# Altium schematic sheet main.SchDoc
size A4; SheetNumber: 1; SheetTotal: 4
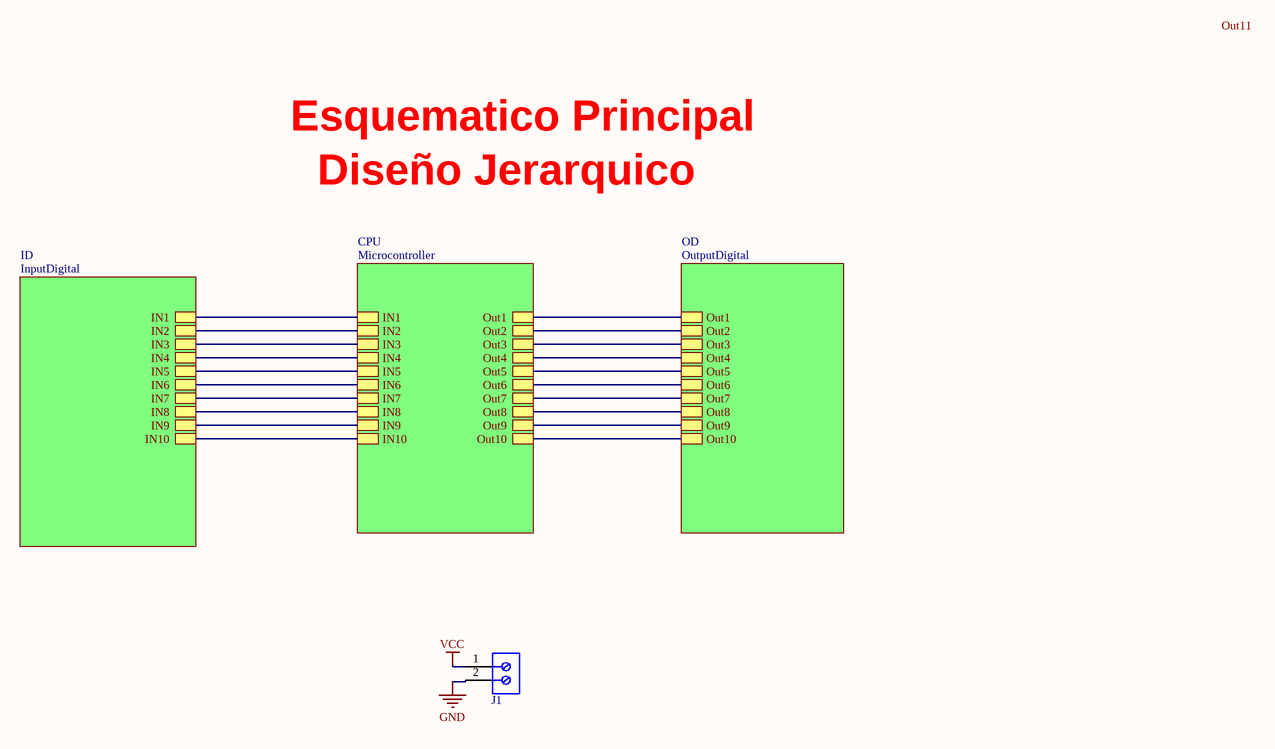
[diagram p0: main.SchDoc]

## Parts
J1  691214110002  [691214110002]  (value not drawn)

## Sub-sheets
CPU = Microcontroller: IN1, IN2, IN3, IN4, IN5, IN6, IN7, IN8, IN9, IN10, Out1, Out2, Out3, Out4, Out5, Out6, Out7, Out8, Out9, Out10
ID = InputDigital: IN1, IN2, IN3, IN4, IN5, IN6, IN7, IN8, IN9, IN10
OD = OutputDigital: Out1, Out2, Out3, Out4, Out5, Out6, Out7, Out8, Out9, Out10

## Nets
GND: J1.2
VCC: J1.1
(unnamed): sheet ID/IN1, sheet CPU/IN1
(unnamed): sheet ID/IN2, sheet CPU/IN2
(unnamed): sheet ID/IN3, sheet CPU/IN3
(unnamed): sheet ID/IN4, sheet CPU/IN4
(unnamed): sheet ID/IN5, sheet CPU/IN5
(unnamed): sheet ID/IN6, sheet CPU/IN6
(unnamed): sheet ID/IN7, sheet CPU/IN7
(unnamed): sheet ID/IN8, sheet CPU/IN8
(unnamed): sheet ID/IN9, sheet CPU/IN9
(unnamed): sheet ID/IN10, sheet CPU/IN10
(unnamed): sheet CPU/Out1, sheet OD/Out1
(unnamed): sheet CPU/Out2, sheet OD/Out2
(unnamed): sheet CPU/Out3, sheet OD/Out3
(unnamed): sheet CPU/Out4, sheet OD/Out4
(unnamed): sheet CPU/Out5, sheet OD/Out5
(unnamed): sheet CPU/Out6, sheet OD/Out6
(unnamed): sheet CPU/Out7, sheet OD/Out7
(unnamed): sheet CPU/Out8, sheet OD/Out8
(unnamed): sheet CPU/Out9, sheet OD/Out9
(unnamed): sheet CPU/Out10, sheet OD/Out10

## Notes on the sheet
- Esquematico Principal
- Diseño Jerarquico
- Labels drawn without touching a wire or pin: Out11

## Library data of the parts
J1 = CMP-1502-02464-1: Serie 2141 - 3.50 mm Horizontal Entry Modular with Rising Cage Clamp WR-TBL, 2 pin; Manufacturer: Wurth Elektronik; Pin Number: 2; Pitch: 3.50mm; Datasheet URL: http://katalog.we-online.de/em/datasheet/6912141100xx.pdf; Packaging: Box; Mounting Technology: THT; Package Reference: 691214110002; Manufacturer URL: http://www.we-online.de; Part Number: 691214110002; Publisher: WurthElektronik; Operating Temperature: -40to105degC